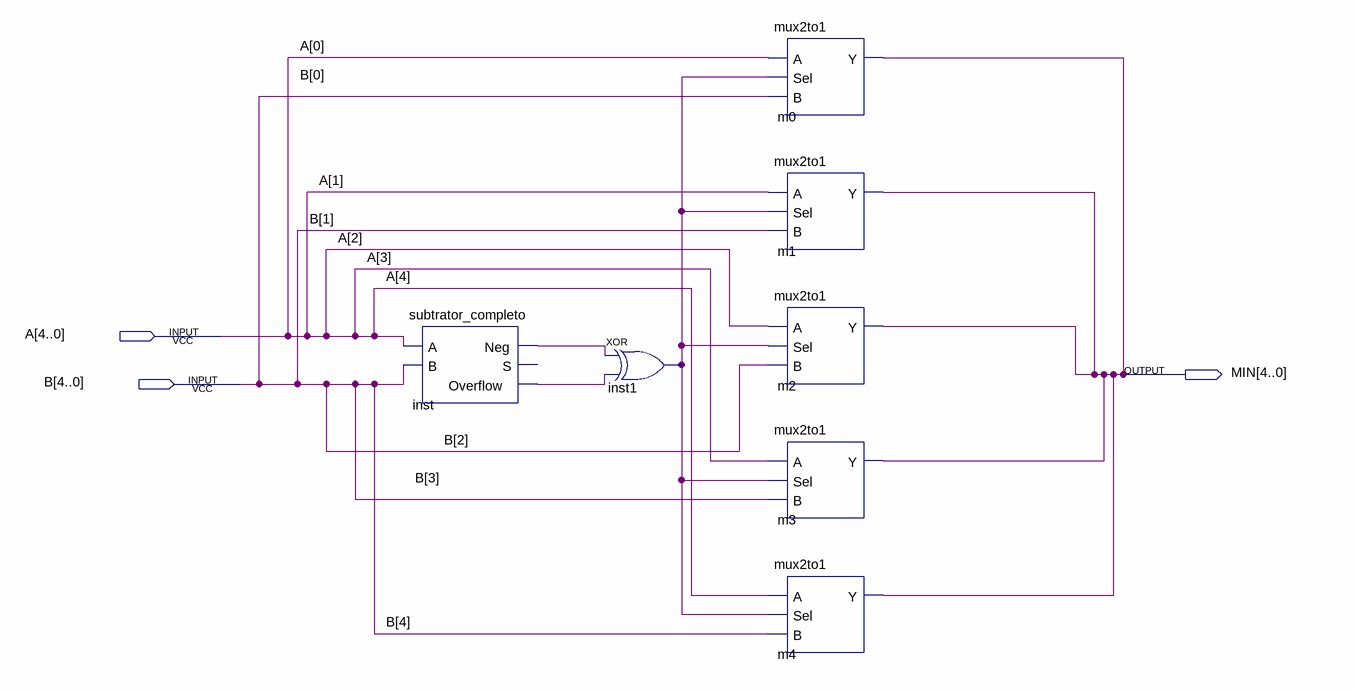
[diagram p0: schematic sheet]
// Quartus schematic min_a,b.bdf as structural Verilog: 7 symbols, 3 pins
module \min_a,b  (
  input  [4:0] A,
  input  [4:0] B,
  output [4:0] MIN
);

  wire inst1_out, inst_neg, inst_overflow, m0_y;

  subtrator_completo inst (.A(A[4]), .B(B[4]), .Neg(inst_neg), .Overflow(inst_overflow));  // open: S
  xor inst1 (inst1_out, inst_neg, inst_overflow);
  mux2to1 m0 (.A(A[4]), .Sel(inst1_out), .B(B[4]), .Y(m0_y));
  mux2to1 m1 (.A(A[4]), .Sel(inst1_out), .B(B[4]), .Y(m0_y));
  mux2to1 m2 (.A(A[4]), .Sel(inst1_out), .B(B[4]), .Y(m0_y));
  mux2to1 m3 (.A(A[4]), .Sel(inst1_out), .B(B[4]), .Y(m0_y));
  mux2to1 m4 (.A(A[4]), .Sel(inst1_out), .B(B[4]), .Y(m0_y));

  assign A[3:0] = {4{A[4]}};
  assign B[3:0] = {4{B[4]}};
endmodule
